# EAGLE design Faulhaber Temp sensor  w CPU (EAGLE 9.6.2)
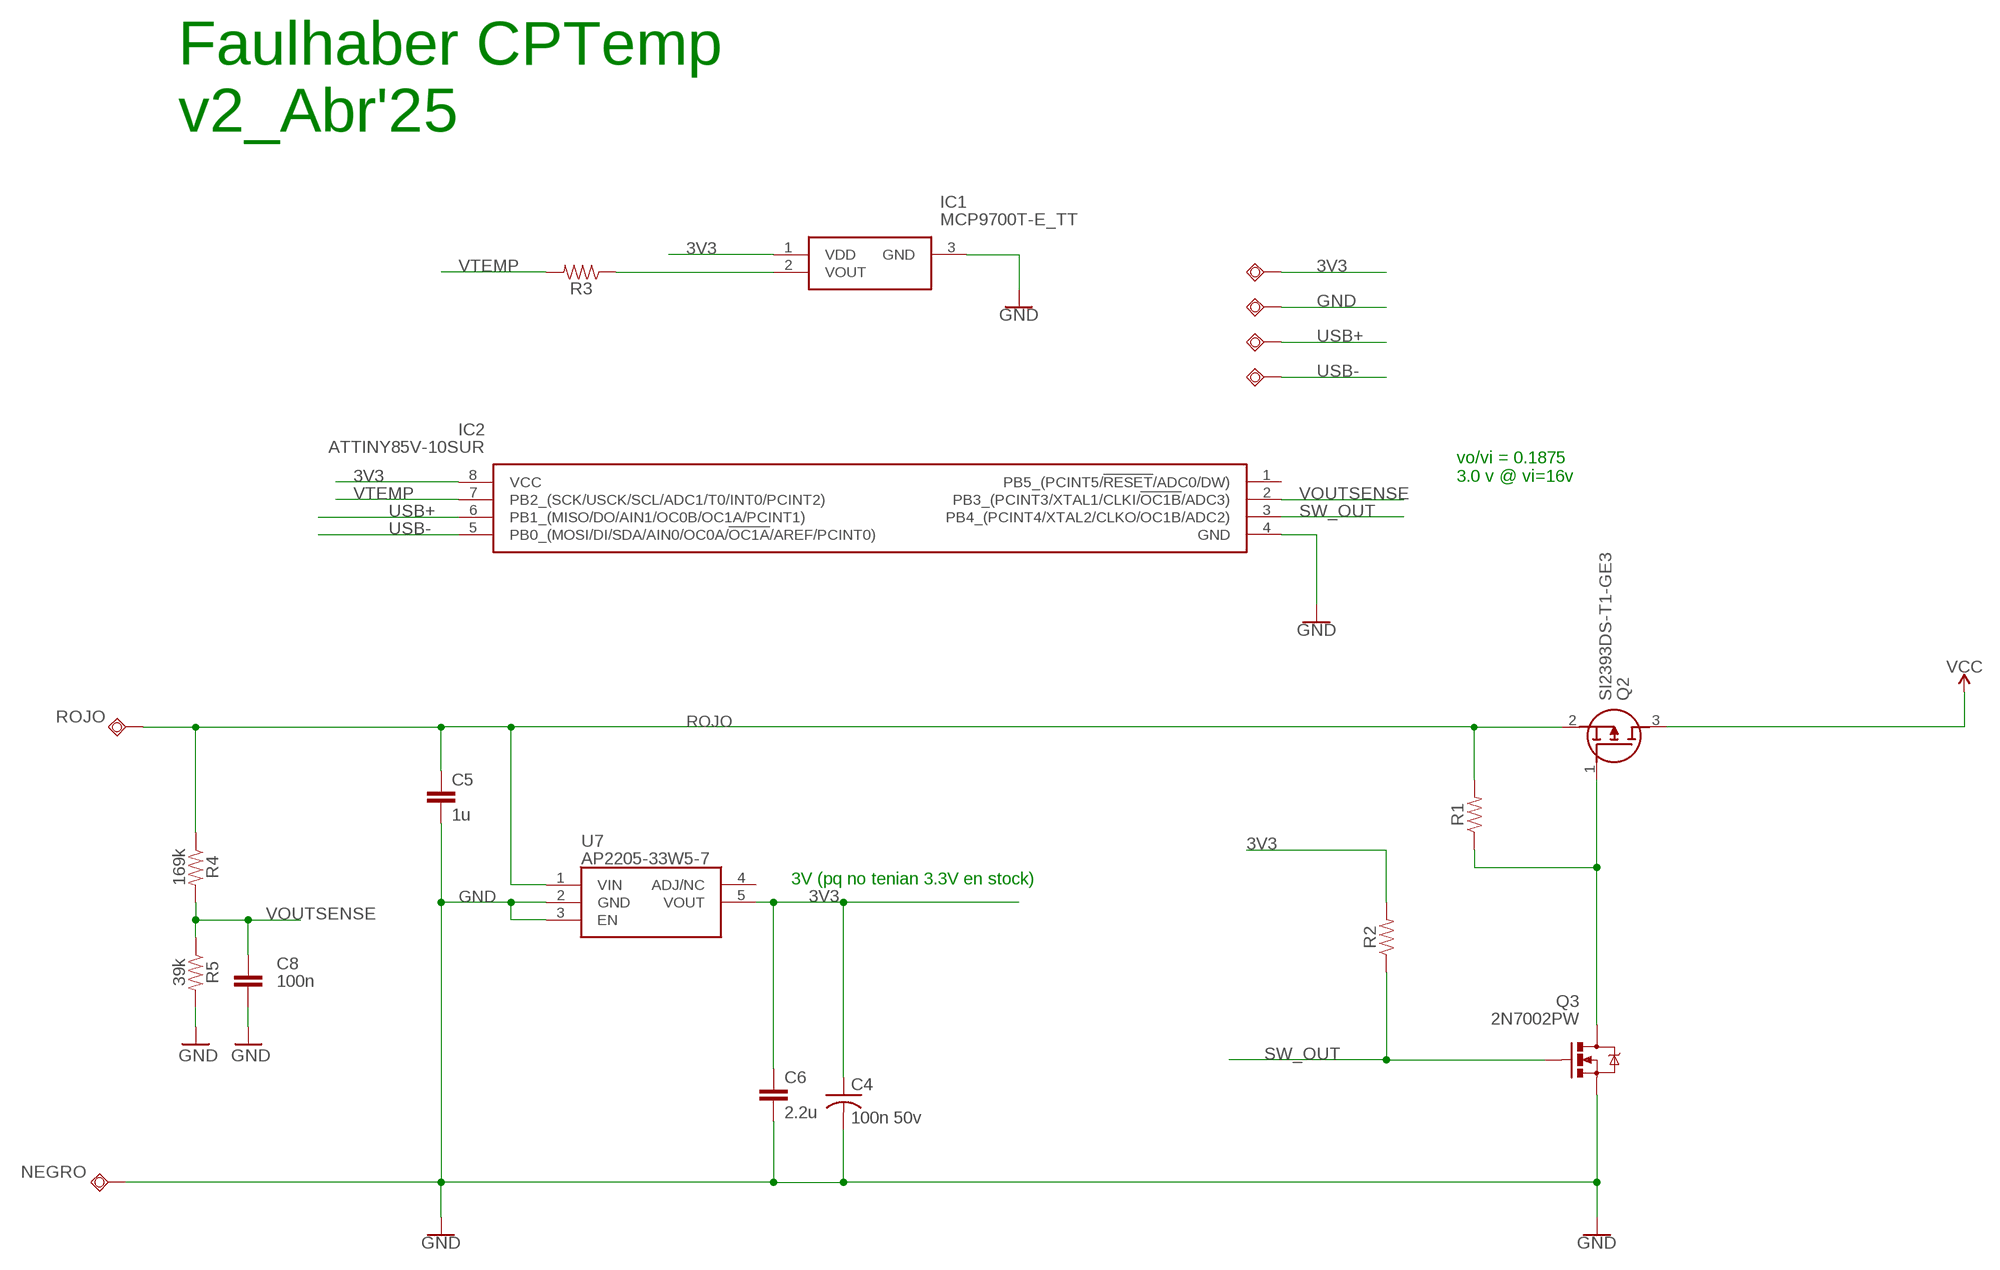
[diagram p0: schematic, sheet 1]

## Parts
3V3  TESTPAD_TPSQB1,27  [TESTPAD_B1,27]
C4  100n 50v  C-USC0805  [C0805]
C5  1u  4.7UF-6.3V-10%(0603)0603  [0603-CAP]
C6  2.2u  4.7UF-6.3V-10%(0603)0603  [0603-CAP]
C8  100n  0.1UF-0603-25V-(+80/-20%)  [0603]
GND  TESTPAD_TPSQB1,27  [TESTPAD_B1,27]
IC1  MCP9700T-E_TT  [SOT95P237X112-3N]
IC2  ATTINY85V-10SUR  [SOIC127P798X216-8N]
NEGRO  TESTPAD_TPSQTP10SQ  [TESTPAD_TP10SQ]
Q2  SI2393DS-T1-GE3  [SOT95P237X112-3N]
Q3  2N7002PW  MOSFET-NCHANNEL2N7002PW  [SOT323]
R1  RESISTOR0603  [0603]
R2  RESISTOR0603  [0603]
R3  RESISTOR0603  [0603]
R4  169k  RESISTOR0603  [0603]
R5  39k  RESISTOR0603  [0603]
ROJO  TESTPAD_TPSQTP10SQ  [TESTPAD_TP10SQ]
U7  AP2205-33W5-7  AP2205-W5-7  [SOT95P282X145-5N]
USB+  TESTPAD_TPSQB1,27  [TESTPAD_B1,27]
USB-  TESTPAD_TPSQB1,27  [TESTPAD_B1,27]

## Nets
3V3: 3V3.TP C4.1 C6.1 IC1.1(VDD) IC2.8(VCC) R2.2 U7.5(VOUT)
GND: C4.2 C5.2 C6.2 C8.2 GND.TP IC1.3(GND) IC2.4(GND) NEGRO.TP Q3.2(S) R5.2 U7.2(GND) U7.3(EN)
N$1: IC1.2(VOUT) R3.1
N$3: Q2.1(G) Q3.3(D) R1.1
ROJO: C5.1 Q2.2(S) R1.2 R4.1 ROJO.TP U7.1(VIN)
SW_OUT: IC2.3(PB4_(PCINT4/XTAL2/CLKO/OC1B/ADC2)) Q3.1(G) R2.1
USB+: IC2.6(PB1_(MISO/DO/AIN1/OC0B/OC1A/PCINT1)) USB+.TP
USB-: IC2.5(PB0_(MOSI/DI/SDA/AIN0/OC0A/!OC1A!/AREF/PCINT0)) USB-.TP
VCC: Q2.3(D)
VOUTSENSE: C8.1 IC2.2(PB3_(PCINT3/XTAL1/CLKI/!OC1B!/ADC3)) R4.2 R5.1
VTEMP: IC2.7(PB2_(SCK/USCK/SCL/ADC1/T0/INT0/PCINT2)) R3.2
Unconnected: IC2.1(PB5_(PCINT5/!RESET!/ADC0/DW)) U7.4(ADJ/NC)

## Notes on the sheet
- Faulhaber CPTemp
  v2_Abr'25
- vo/vi = 0.1875
  3.0 v @ vi=16v
- 3V (pq no tenian 3.3V en stock)

## Library data of the parts
3V3 GND NEGRO ROJO USB+ USB- = BeagleBone_Blue_R3:TESTPAD_TPSQ: Test pad
C4 = adafruit:C-US: CAPACITOR, American symbol
C5 C6 = SparkFun-Capacitors:4.7UF-6.3V-10%(0603): CAP-08280; PROD_ID: CAP-08280; VALUE: 4.7uF
C8 = SparkFun-Capacitors:0.1UF: 0.1µF ceramic capacitors A capacitor is a passive two-terminal electrical component used to store electrical energy temporarily in an electric field.; PROD_ID: CAP-00810; VALUE: 0.1uF
IC1 = SamacSys_Parts:MCP9700T-E_TT: Linear Active Thermistor 10mV/C SOT23 Source: Datasheet <https://datasheet.datasheetarchive.com/originals/distributors/Datasheets-DGA2/179941.pdf>; ARROW_PART_NUMBER: MCP9700T-E/TT; ARROW_PRICE-STOCK: https://www.arrow.com/en/products/mcp9700t-ett/microchip-technology?utm_currency=USD&region=nac; DESCRIPTION: Linear Active Thermistor 10mV/C SOT23; HEIGHT: 1.12mm; MANUFACTURER_NAME: Microchip; MANUFACTURER_PART_NUMBER: MCP9700T-E/TT; MOUSER_PART_NUMBER: 579-MCP9700T-E/TT; MOUSER_PRICE-STOCK: https://www.mouser.co.uk/ProductDetail/Microchip-Technology/MCP9700T-E-TT?qs=QVBMgXxBiLyzQ04uBGj3mg%3D%3D
IC2 = SamacSys_Parts:ATTINY85V-10SUR: MICROCHIP - ATTINY85V-10SUR - MCU, 8BIT, AVR, 10MHZ, WSOIC-8 Source: Datasheet <https://componentsearchengine.com/Datasheets/2/ATTINY85V-10SUR.pdf>; DESCRIPTION: MICROCHIP - ATTINY85V-10SUR - MCU, 8BIT, AVR, 10MHZ, WSOIC-8; FARNELL2_PART_NUMBER: 2851618RL; FARNELL2_PRICE-STOCK: http://uk.farnell.com/jsp/displayProduct.jsp?sku=2851618RL&action=view; HEIGHT: 2.16mm; MANUFACTURER_NAME: Microchip; MANUFACTURER_PART_NUMBER: ATTINY85V-10SUR
Q2 = SamacSys_Parts:SI2393DS-T1-GE3: P-Channel 30-V (D-S) MOSFET SOT-23 , 22.7 m @ 10V m @ 7.5V 33 m @ 4.5V Source: Datasheet <https://www.arrow.com/en/products/si2393ds-t1-ge3/vishay>; ARROW_PART_NUMBER: SI2393DS-T1-GE3; ARROW_PRICE-STOCK: https://www.arrow.com/en/products/si2393ds-t1-ge3/vishay?utm_currency=USD&region=nac; DESCRIPTION: P-Channel 30-V (D-S) MOSFET SOT-23 , 22.7 m @ 10V m @ 7.5V 33 m @ 4.5V; HEIGHT: 1.12mm; MANUFACTURER_NAME: Vishay; MANUFACTURER_PART_NUMBER: SI2393DS-T1-GE3; MOUSER_PART_NUMBER: 78-SI2393DS-T1-GE3; MOUSER_PRICE-STOCK: https://www.mouser.co.uk/ProductDetail/Vishay-Semiconductors/SI2393DS-T1-GE3?qs=BJlw7L4Cy7%2FUF13oxTStOQ%3D%3D
Q3 = SparkFun-DiscreteSemi:MOSFET-NCHANNEL: Common NMOSFET Parts MFG P/N Store ID Prod ID FDD8780 TRANS-09984 SI7820DN TRANS-11055 FDS6630A IC-08089 2N7002PW TRANS-11151 FQP30N06L COM-10213 TRANS-10060 BSS123LT1G TRANS-08345 BSS138 TRANS-00830 BS170 2N7000; PROD_ID: TRANS-11151
R1-R5 = SparkFun-Resistors:RESISTOR: Generic Resistor Package
U7 = AP2205-W5-7:AP2205-W5-7: LDO Voltage Regulators LDO CMOS LowCurr Source: Datasheet <https://www.diodes.com/assets/Datasheets/AP2206.pdf>; DESCRIPTION: LDO Voltage Regulators LDO CMOS LowCurr; HEIGHT: 1.45mm; MANUFACTURER_NAME: Diodes Inc.; MANUFACTURER_PART_NUMBER: AP2205-W5-7; MOUSER_PART_NUMBER: 621-AP2205-W5-7; MOUSER_PRICE-STOCK: https://www.mouser.com/Search/Refine.aspx?Keyword=621-AP2205-W5-7

## Board
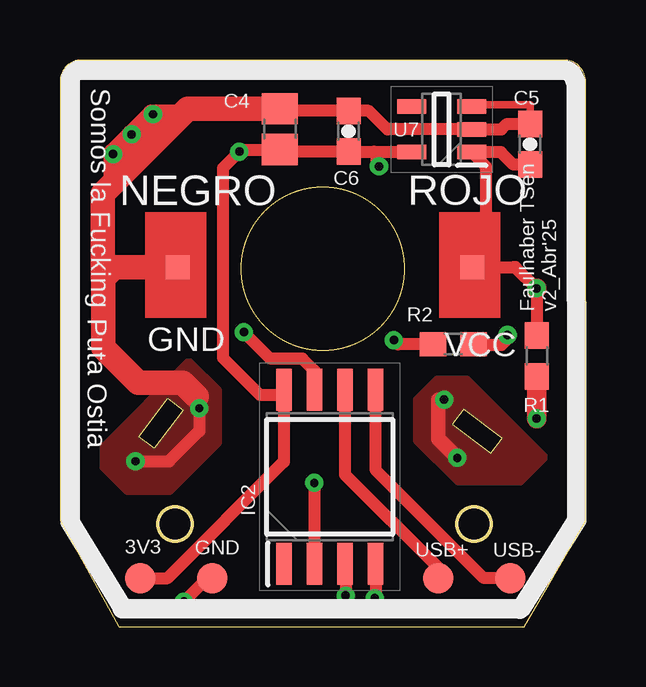
[diagram p1: board, top side]
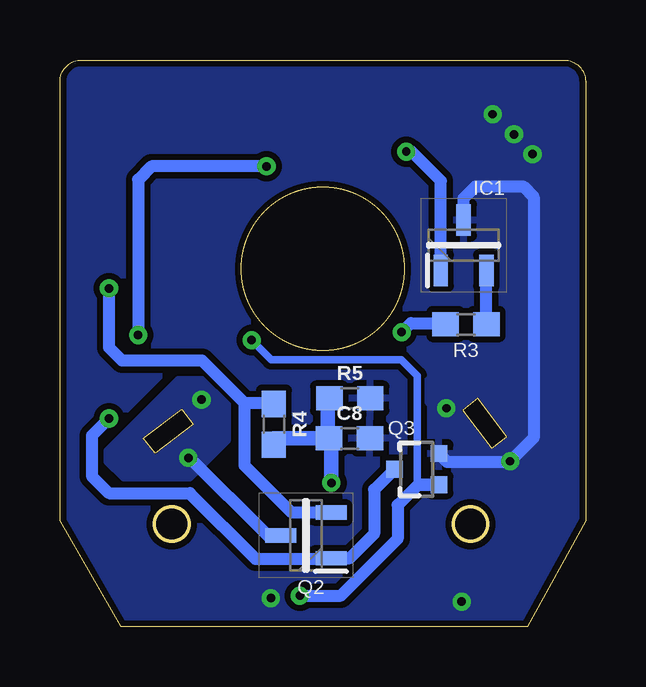
[diagram p2: board, bottom side, seen from below]

Size 21.9 x 23.62 mm. Coordinates in mm from the lower left corner, seen from the top.
Outline: 16.83,9.07 16.35,8.43 17.94,7.22 18.42,7.86 16.83,9.07
Outline: 5.13,9.03 3.92,7.44 3.28,7.92 4.49,9.52 5.13,9.03
Outline: 21.9,22.72 arc90 21,23.62 0.9,23.62 arc90 0,22.72 0,4.42 2.44,0 19.34,0 21.9,4.42 21.9,22.72
Outline: circle at 10.94,14.91 radius 3.4
Outline: circle at 4.8,4.28 radius 0.71
Outline: circle at 17.24,4.28 radius 0.71
Copper layers (1*16): Top 0.035mm / dielectric 1.5mm / Bottom 0.035mm
Design rules "default *": minimum track width 6mil, minimum drill 0.35mm, track to track 6mil, track to pad 6mil, pad to pad 6mil, via to via 6mil, smd to smd 0mil, copper to edge 1mil, drill to drill 6mil, minimum pad ring 10mil, minimum via ring 8mil, stop-mask expansion 4mil, vias tented up to drill 0mil, thermal gap 10mil

### Footprints (pad centres in the part's own frame; a part is rotated, then mirrored left to right if it is on the bottom)
TESTPAD_B1,27 = smd 1.27 x 1.27: TP 0,0
C0805 = smd 1.3 x 1.5: 1 -0.85,0; 2 0.85,0
0603-CAP = smd 1.1 x 1: 1 -0.85,0; 2 0.85,0
0603 = smd 1.1 x 1: 1 -0.85,0; 2 0.85,0
SOT95P237X112-3N = smd 1.3 x 0.6: 1 -1.05,0.95; 2 -1.05,-0.95; 3 1.05,0
SOIC127P798X216-8N = smd 1.75 x 0.65: 1 -3.625,1.905; 2 -3.625,0.635; 3 -3.625,-0.635; 4 -3.625,-1.905; 5 3.625,-1.905; 6 3.625,-0.635; 7 3.625,0.635; 8 3.625,1.905
TESTPAD_TP10SQ = smd 1 x 1: TP 0,0
SOT323 = smd 0.7 x 0.7: 1 -0.65,-0.925; 2 0.65,-0.925; 3 0,0.925
SOT95P282X145-5N = smd 1.2 x 0.6: 1 -1.25,0.95; 2 -1.25,0; 3 -1.25,-0.95; 4 1.25,-0.95; 5 1.25,0.95

### Placement (x,y rotation side)
3V3  3.34,2.03 0 top
C4  9.16,20.74 90 top
C5  19.58,20.11 90 top
C6  12.02,20.65 90 top
C8  9.83,7.85 0 bottom
GND  6.34,2.03 0 top
IC1  5.08,15.9 90 bottom
IC2  11.24,6.25 90 top
NEGRO  4.9,14.99 0 top
Q2  11.65,3.81 180 bottom
Q3  7.03,6.57 90 bottom
R1  19.87,11.29 90 top
R2  16.38,11.78 0 top
R3  4.98,12.61 180 bottom
R4  12.99,8.44 270 bottom
R5  9.82,9.52 0 bottom
ROJO  17.18,14.99 0 top
U7  15.9,20.73 180 top
USB+  15.75,2.03 0 top
USB-  18.75,2.03 0 top

### Tracks (layer width: path | path; a pad name or v marks a point on that pad's centre or on a via)
3V3  (via drill 0.35)
  Top 0.305: R2.2 17.26,11.75 | v13.29,19.19 13.09,19.39 13.09,19.8
  Top 0.508: U7.5 14.63,19.8 13.09,19.8 C6.1 9.25,19.8 C4.1 7.56,19.89 v7.47,19.8 6.79,19.12 6.79,11.2 8.34,9.66 9.32,9.66 9.33,9.67 IC2.8 9.32,6.87 4.48,2.03 3V3.TP | 17.26,11.75 18.4,11.75 18.64,11.99 v18.64,12.16
  Bottom 0.508: IC1.1 6.03,18.58 7.25,19.8 v7.47,19.8 | v13.29,19.19 18.09,19.19 18.64,18.64 v18.64,12.16
GND  (via drill 0.35)
  Top 0.305: U7.3 17.22,21.75 19.58,21.75 C5.2
  Top 0.508: C4.2 9.25,21.5 C6.2 12.87,21.5 13.64,20.73 U7.2 18.39,20.73 18.62,20.96 C5.2 | v5.8,9.11 5.8,8.17 4.53,6.9 v3.14,6.9 3.14,6.88 | IC2.4 13.15,1.24 v13.11,1.2 | GND.TP 6.14,2.03 v5.16,1.05
  Top 0.813: 2.64,18.9 2.21,19.33 v2.21,19.7 | v2.21,19.7 2.21,19.75 v2.98,20.52 3.82,21.36 v3.87,21.36 5.1,21.36 5.33,21.59 | v2.21,19.7 2.21,18.48 1.77,18.04
  Top 1.016: NEGRO.TP 2.26,14.99 1.79,14.52 | 1.79,14.52 1.77,14.5 1.77,18.04 2.64,18.9 5.33,21.59 C4.2 | 1.79,14.52 1.79,11.63 3.25,10.17 5.12,10.17 5.7,9.6
  Bottom 0.508: Q3.2 5.77,6.88 3.16,6.88 v3.14,6.9 2.16,7.88 2.16,17.91 2.6,18.35 4.58,18.35 5.08,17.85 IC1.3
  pour Bottom: 5.34,11.38 1.7,7.04 3.43,5.58 7.08,9.92
  pour Bottom (isolate 0.254, rank 2): 0.04,24.1 21.54,24.1 22.64,23 22.64,3.4 19.1,-0.14 2.38,-0.14 -0.61,2.85 -0.61,23.45
  pour Top: 2.79,5.66 1.79,6.66 1.79,7.48 5.37,11.06 6.58,9.85 6.58,7.67 4.57,5.66
N$1
  Bottom 0.508: R3.1 IC1.2
N$3  (via drill 0.35)
  Top 0.813: R1.1 19.87,8.7 v19.86,8.68
  Bottom 0.508: Q3.3 8.81,5.72 8.81,3.87 9.82,2.86 Q2.1 10.63,2.83 13.75,2.83 16.49,5.57 19.86,5.57 20.57,6.28 20.57,7.97 v19.86,8.68
ROJO  (via drill 0.35)
  Top 0.508: C5.1 18.89,19.26 18.37,19.78 U7.1 | ROJO.TP 17.19,15 | 17.19,19.74 U7.1 | ROJO.TP 18.9,14.99 18.98,14.99 v19.86,14.11 | ROJO.TP 17.74,15.55 17.74,19.19 U7.1 | 19.87,14.09 R1.2
  Top 0.813: v19.86,14.11 19.87,14.09
  Bottom 0.508: Q2.2 12.24,4.76 14.2,6.72 14.2,9.32 | v19.86,14.11 19.86,11.63 19.31,11.09 15.97,11.09 14.2,9.32 | R4.1 13.02,9.32 14.2,9.32
SW_OUT  (via drill 0.35)
  Top 0.508: R2.1 14.09,11.77 v13.91,11.95 | IC2.3 11.9,2.6 v11.9,1.3
  Bottom 0.305: v13.91,11.95 13.09,11.13 7.68,11.13 7.02,10.47 7.02,6.12 6.83,5.92
  Bottom 0.508: v11.9,1.3 10.19,1.3 7.83,3.67 7.83,5.07 6.98,5.92 Q3.1 6.83,5.92
USB+
  Top 0.508: USB+.TP 15.75,2.46 11.87,6.34 IC2.6
USB-
  Top 0.508: USB-.TP 17.66,2.03 13.14,6.55 IC2.5
VCC  (via drill 0.35)
  Top 0.61: 15.75,9.46 15.75,7.84 v16.55,7.04
  Bottom 0.508: Q2.3 13.25,3.81 16.52,7.08 v16.55,7.04
  other vias: 16,9.47
  pour Top: 14.87,9.46 15.72,10.31 16.95,10.31 20.19,7.07 19.17,6.05 16.58,6.05 14.87,7.76
  pour Bottom: 14.92,9.48 15.74,10.3 16.96,10.3 19.92,7.34 19.92,6.89 19.24,6.21 16.49,6.21 14.92,7.78
VOUTSENSE  (via drill 0.35)
  Top 0.508: v10.6,5.99 IC2.2
  Top 0.61: v10.59,6 v10.6,5.99
  Bottom 0.61: v10.59,6 10.59,7.76 C8.1 | C8.1 12.98,7.85 R4.2 | R5.1 10.67,9.3 10.73,9.24 10.73,7.9 C8.1
VTEMP  (via drill 0.35)
  Top 0.508: v7.66,12.28 8.76,11.18 10.1,11.18 10.6,10.68 IC2.7
  Bottom 0.508: v7.66,12.28 7.28,12.66 5.88,12.66 R3.2
(copper drawn outside any net)
  shapes: Top area x2

### Text on the board
tPlace: Somos la Fucking | Faulhaber TSen / v2_Abr'25 | GND | VCC | Puta Ostia